# Altium schematic sheet PX4FLOW2.0_Sensors_CAN_X0.SchDoc
size A4; DrawnBy: Philip Rowse
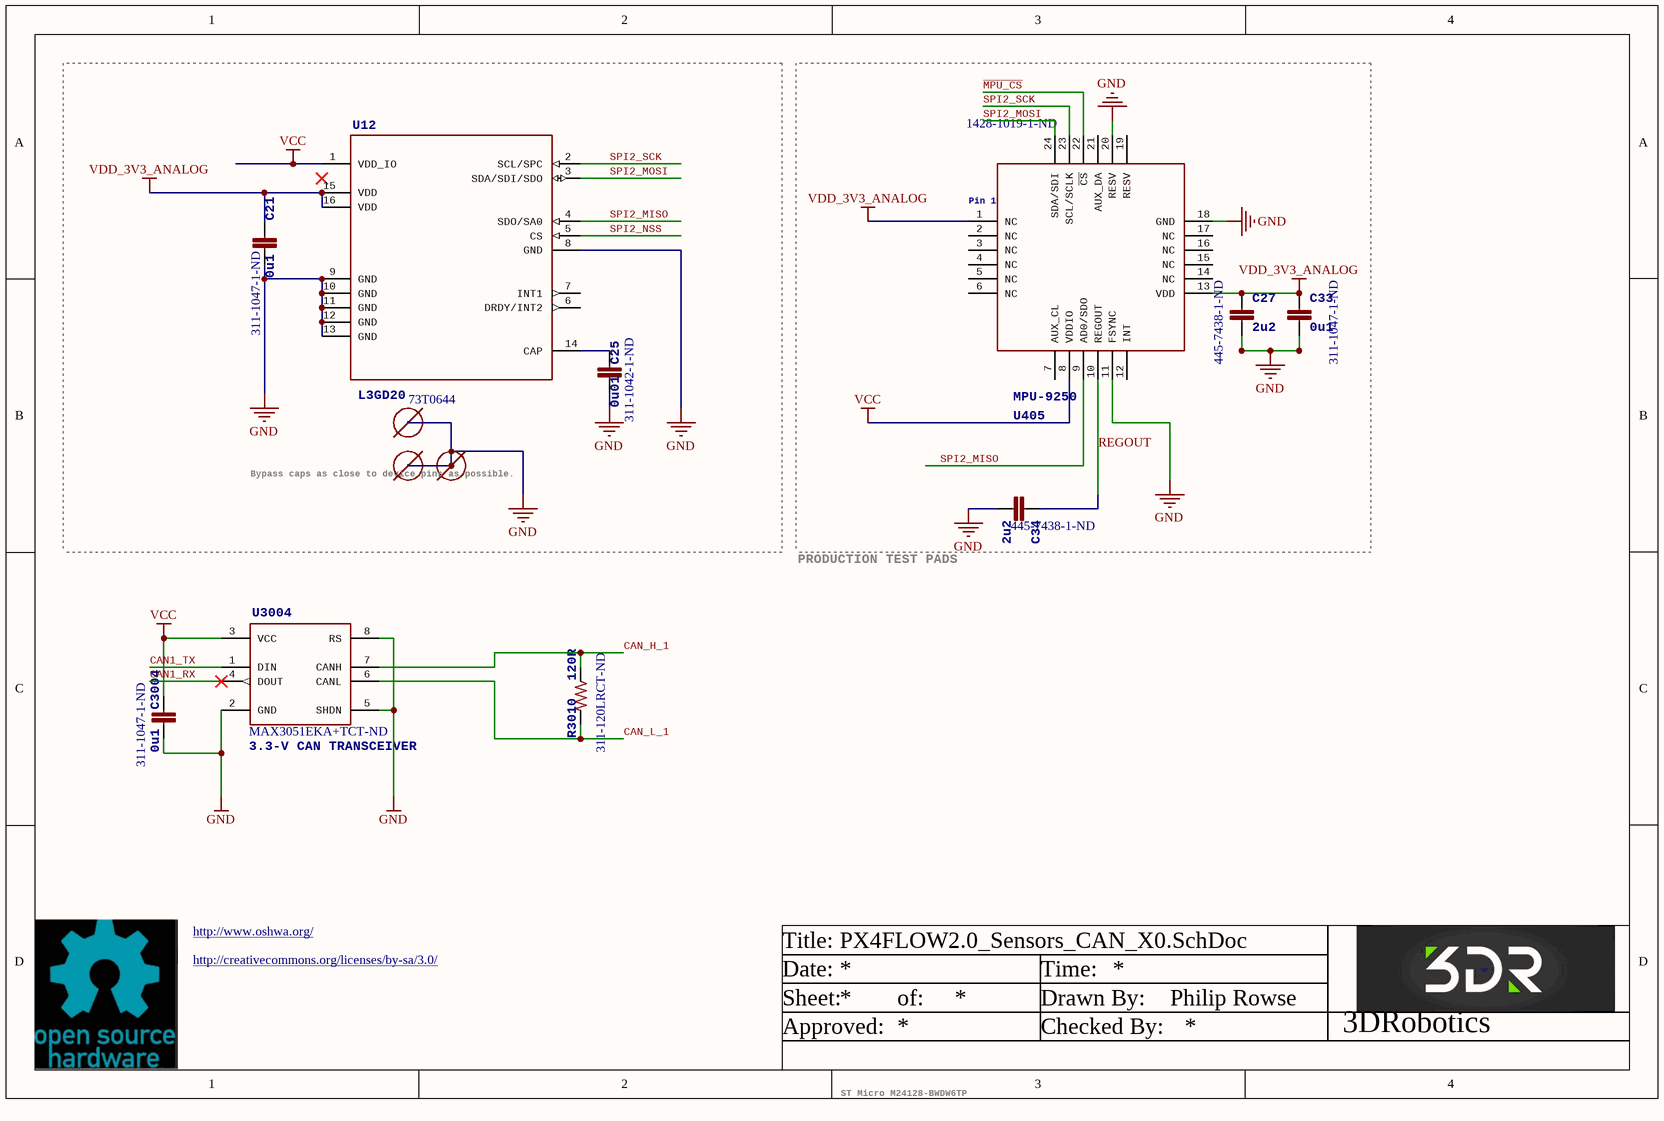
[diagram p0: PX4FLOW2.0_Sensors_CAN_X0.SchDoc]

## Parts
C21  0u1  Supplier Part Number 1: 311-1047-1-ND  [0402-CAP]
C25  0u01  Supplier Part Number 1: 311-1042-1-ND  [0402-CAP]
C27  2u2  Supplier Part Number 1: 445-7438-1-ND  [0603-CAP]
C33  0u1  Supplier Part Number 1: 311-1047-1-ND  [0402-CAP]
C34  2u2  Supplier Part Number 1: 445-7438-1-ND  [0603-CAP]
C3004  0u1  Supplier Part Number 1: 311-1047-1-ND  [0402-CAP]
R3010  120R  Supplier Part Number 1: 311-120LRCT-ND  [R0402]
U12  L3GD20  Supplier Part Number 1: 73T0644  [L3GD20]
U405  MPU-9250  Supplier Part Number 1: 1428-1019-1-ND  [MPU-6500]
U3004  3.3-V CAN TRANSCEIVER  Supplier Part Number 1: MAX3051EKA+TCT-ND  [SOT23-8]
U$1  MOUNT-HOLE3.1MM  [MOUNT-HOLE3.1]  (value not drawn)
U$3  MOUNT-HOLE3.1MM  [MOUNT-HOLE3.1]  (value not drawn)
U$4  MOUNT-HOLE3.1MM  [MOUNT-HOLE3.1]  (value not drawn)

## Blocks framed on the sheet
Bypass caps as close to device pins as possible.: C21 C25 U12 U$1 U$3 U$4

## Nets
GND: C21.2 C25.2 C27.P$2 C33.P$2 C34.P$2 C3004.P$2 U12.8(GND) U12.9(GND) U12.10(GND) U12.11(GND) U12.12(GND) U12.13(GND) U405.11(FSYNC) U405.18(GND) U405.20(RESV) U3004.2(GND) U3004.5(SHDN) U3004.8(RS) U$1.1 U$3.1 U$4.1
VCC: C3004.P$1 U12.1(VDD_IO) U405.8(VDDIO) U3004.3(VCC)
VDD_3V3_ANALOG: C21.1 C27.P$1 C33.P$1 U12.15(VDD) U12.16(VDD) U405.1(NC) U405.13(VDD)
CAN1_RX: U3004.4(DOUT)
CAN1_TX: U3004.1(DIN)
CAN_H_1: R3010.1 U3004.7(CANH)
CAN_L_1: R3010.2 U3004.6(CANL)
~{MPU_CS}: U405.22(~{CS})
REGOUT: C34.P$1 U405.10(REGOUT)
SPI2_MISO: U12.4(SDO/SA0) U405.9(AD0/SDO)
SPI2_MOSI: U12.3(SDA/SDI/SDO) U405.24(SDA/SDI)
SPI2_NSS: U12.5(CS)
SPI2_SCK: U12.2(SCL/SPC) U405.23(SCL/SCLK)
NetC25_1: C25.1 U12.14(CAP)

Not connected (* = marked no-connect by the designer): U12 6(DRDY/INT2) 7(INT1); U405 2(NC) 3(NC) 4(NC) 5(NC) 6(NC) 7(AUX_CL) 12(INT) 14(NC) 15(NC) 16(NC) 17(NC) 19(RESV) 21(AUX_DA)

## Notes on the sheet
- PRODUCTION TEST PADS
- ST Micro M24128-BWDW6TP
- http://www.oshwa.org/
- http://creativecommons.org/licenses/by-sa/3.0/
- Title:
- Date:
- Time:
- Sheet:
- Approved:
- of:
- Drawn By:
- Checked By:
- 3DRobotics

## Library data of the parts
C21 = CAP0402-CAP: CapacitorStandard 0603 ceramic capacitor, and 0.1" leaded capacitor.; PARTNO: CC0402ZRY5V7BB104; Supplier 1: Digi-Key
C25 = CAP0402-CAP: CapacitorStandard 0603 ceramic capacitor, and 0.1" leaded capacitor.; PARTNO: CC0402KRX7R7BB103; Supplier 1: Digi-Key
C27 C34 = CAPACITOR-0603: Capacitor, 2.2uF, 16V, 10%, X6S, 0603, Ceramic; PARTNO: C1608X6S1C225K080AC; 3DR_PARTNO: ECM0619; Supplier 1: Digi-Key; Value: 2u2
C33 = CAPACITOR-0402: Capacitor, 0.1uF, 16V, Y5V, 0402, Ceramic; PARTNO: CC0402ZRY5V7BB104; 3DR_PARTNO: ECM0700; Supplier 1: Digi-Key; Value: 0u1
C3004 = CAP0402: CAP CER 0.1UF 16V Y5V 0402; PARTNO: CC0402ZRY5V7BB104; 3DR_PARTNO: ECM0700; Supplier 1: Digi-Key; Value: 0u1
R3010 = RESISTOR0402-RES: RES 120 OHM 1/16W 1% 0402 SMD; PARTNO: RC0402FR-07120RL; 3DR_PARTNO: ECM0820; Supplier 1: Digi-Key; Value: 120R
U12 = L3GD20: Sensor, Low-power, Three-axis, Angular rate; 3DR_PARTNO: ECM0827; MFGPN: L3GD20; Supplier 1: Newark
U405 = MPU-6500: PARTNO: MPU-9250; Pin 1: Pin 1; Supplier 1: Digi-Key
U3004 = MAX3051MAX3051EKA: IC TXRX CAN 1MBPS SOT23-8; 3DR_PARTNO: ECM0831; PARTNO: MAX3051EKA+T; Supplier 1: Digi-Key; Value: CAN